# EasyEDA Pro project sleep-monitor.epro

# Schematic sleep_monitor_sch
Assembly Variant: Basic; Board Name: Board1; Create Date: 2026-03-25; Page Name: P1; Project Name: Sleep_Monitor; Schematic Name: Schematic1; Update Date: 2026-03-25; Company: 嘉立创EDA; Page Size: A4; Version: V1.0
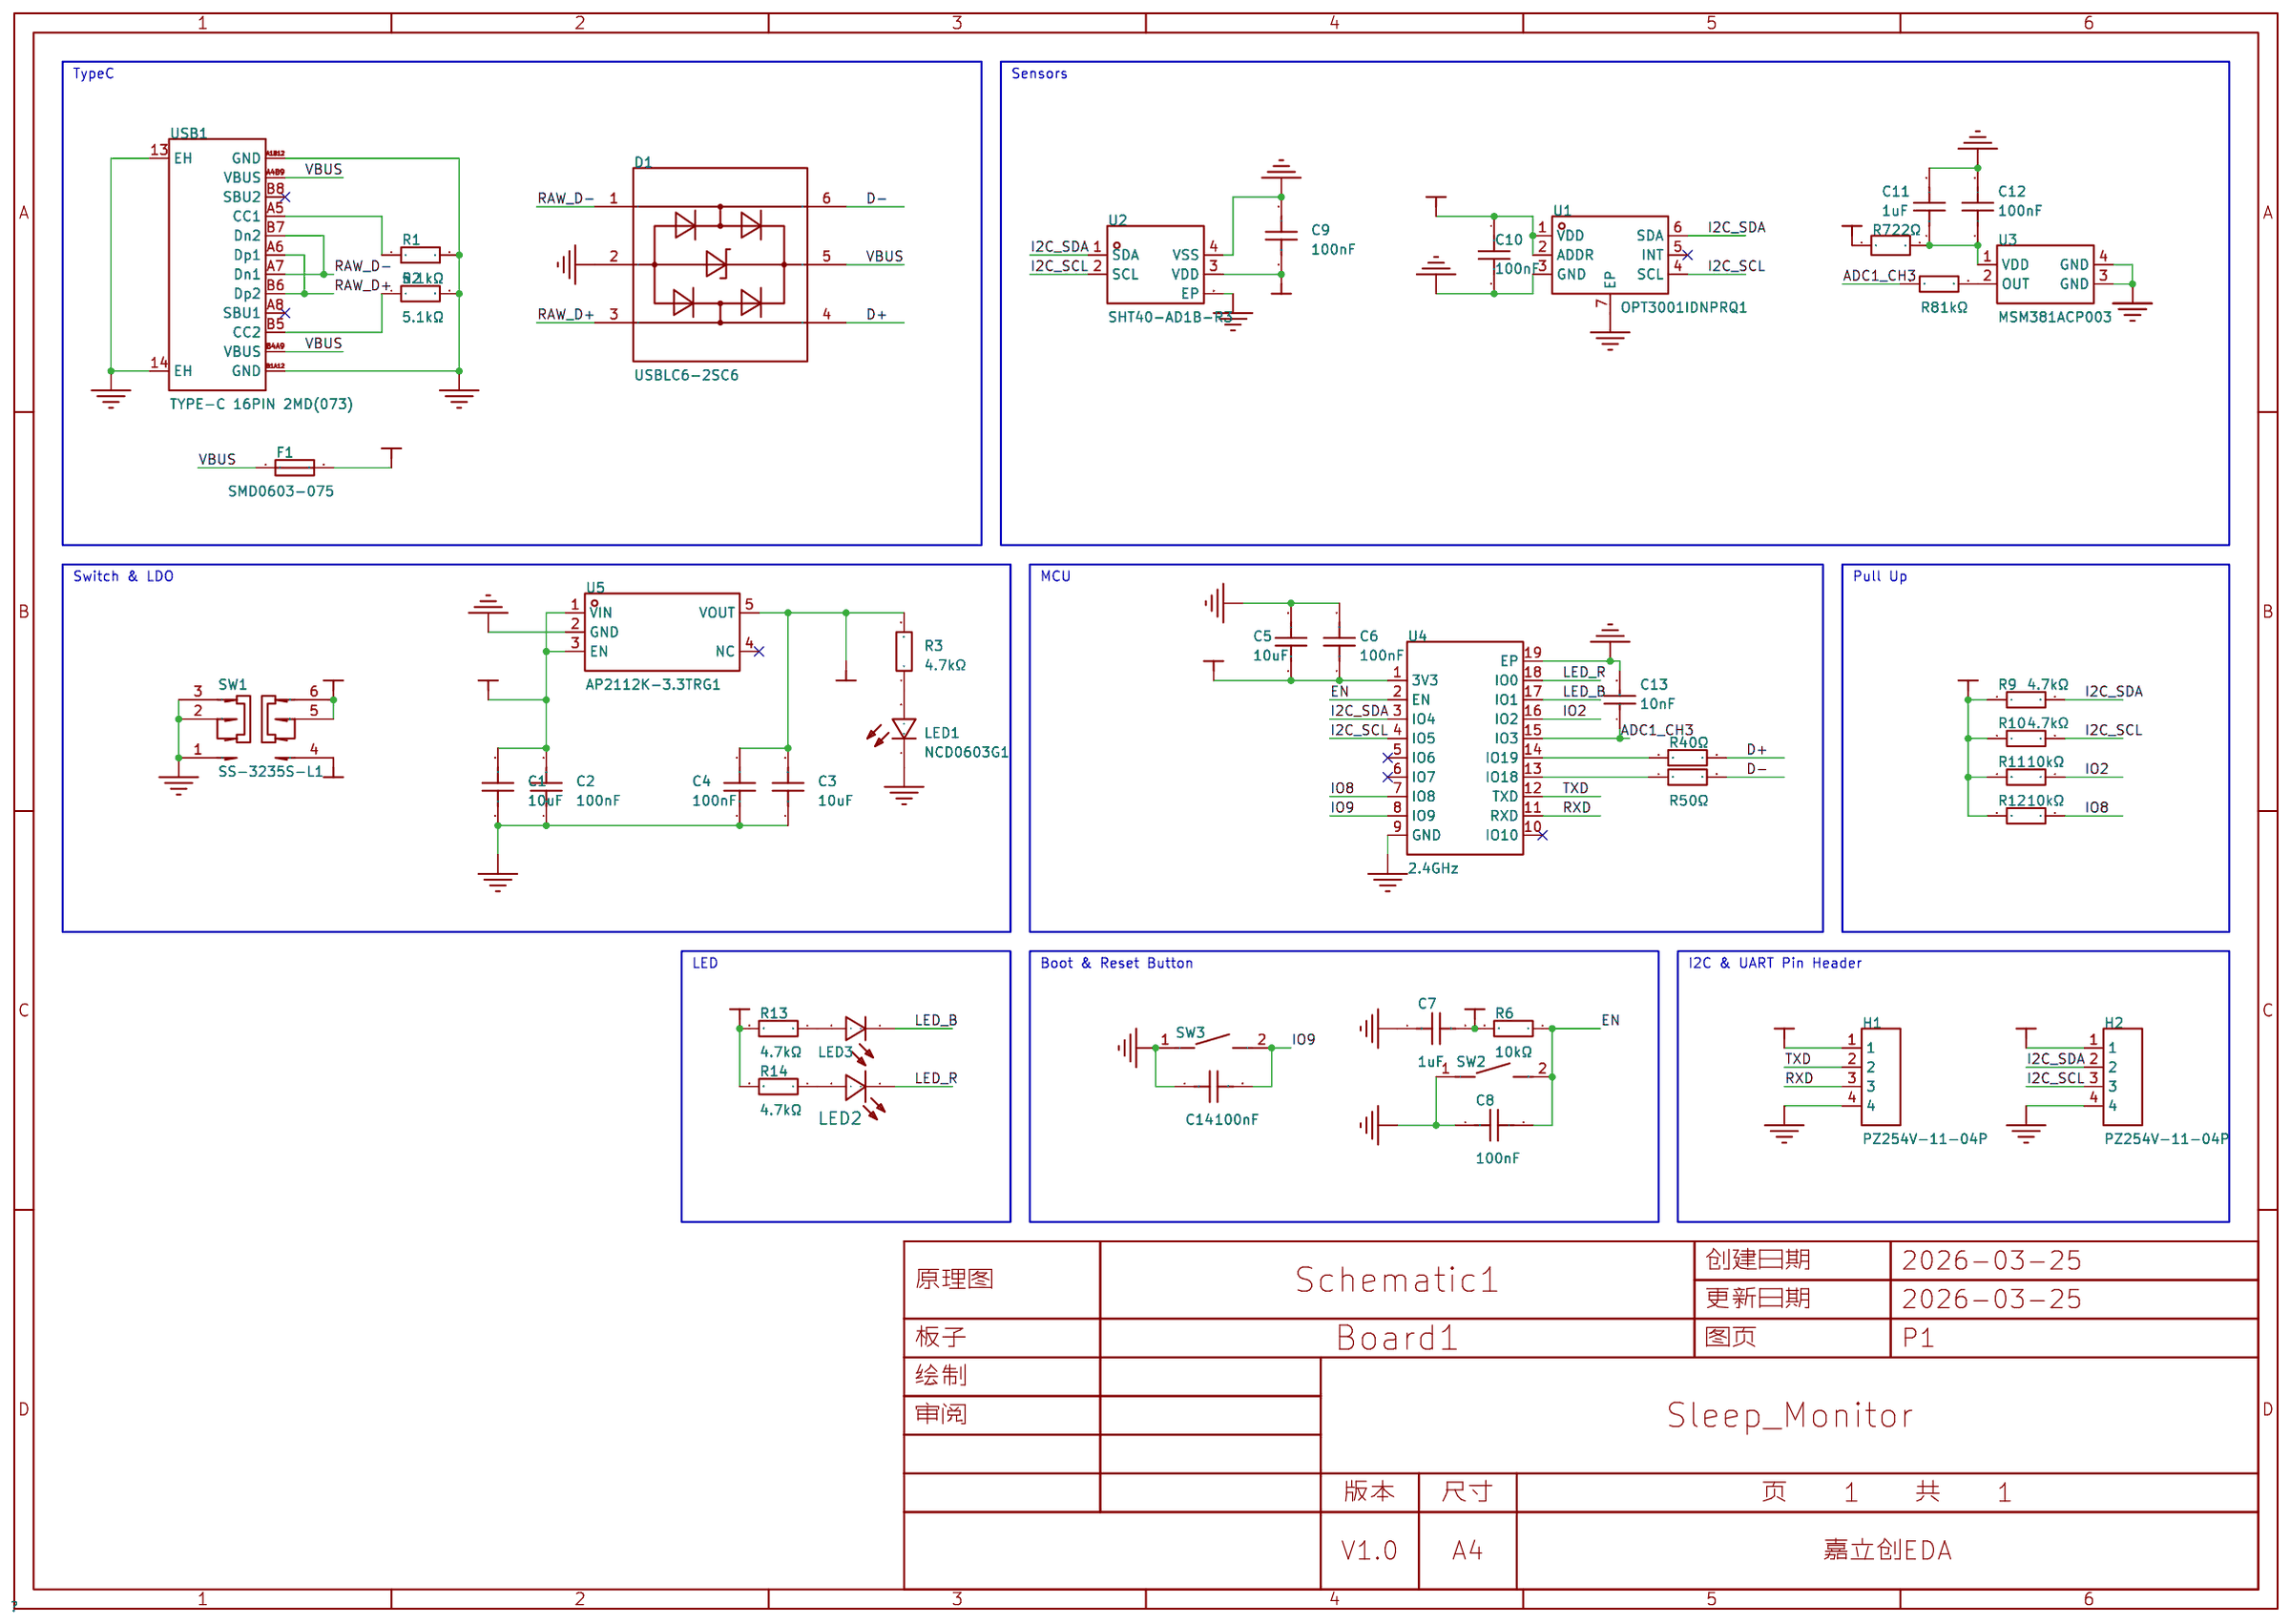
[diagram p0: schematic sheet]

## Parts
C1  10uF  [C0603]
C2  100nF  [C0603]
C3  10uF  [C0603]
C4  100nF  [C0603]
C5  10uF  [C0603]
C6  100nF  [C0603]
C7  1uF  [C0603]
C8  100nF  [C0603]
C9  100nF  [C0603]
C10  100nF  [C0603]
C11  1uF  [C0603]
C12  100nF  [C0603]
C13  10nF  [C0603]
C14  100nF  [C0603]
D1  USBLC6-2SC6  [SOT-23-6_L2.9-W1.6-P0.95-LS2.8-BL]
F1  SMD0603-075  [F0603]
H1  PZ254V-11-04P  [HDR-TH_4P-P2.54-V-M]
H2  PZ254V-11-04P  [HDR-TH_4P-P2.54-V-M]
LED1  NCD0603G1  [LED0603-RD_1]
LED2  NCD0603R5  [LED0603-RD]
LED3  NCD0603B1  [LED0603-RD]
R1  5.1kΩ  [R0603]
R2  5.1kΩ  [R0603]
R3  4.7kΩ  [R0603]
R4  0Ω  [R0603]
R5  0Ω  [R0603]
R6  10kΩ  [R0603]
R7  22Ω  [R0603]
R8  1kΩ  [R0603]
R9  4.7kΩ  [R0603]
R10  4.7kΩ  [R0603]
R11  10kΩ  [R0603]
R12  10kΩ  [R0603]
R13  4.7kΩ  [R0603]
R14  4.7kΩ  [R0603]
SW1  SS-3235S-L1  [SW-SMD_SS-3235S-LX]
SW2  TS-1088-AR02016  [SW-SMD_L3.9-W3.0-P4.45]
SW3  TS-1088-AR02016  [SW-SMD_L3.9-W3.0-P4.45]
U1  OPT3001IDNPRQ1  [WSON-6_L2.0-W2.0-P0.65-BL-EP]
U2  SHT40-AD1B-R3  [DFN-4_L1.5-W1.5-P0.8-TL-EP]
U3  MSM381ACP003  [MIC-SMD_4P-L2.8-W1.9-TR_MSM381ACP003]
U4  2.4GHz  [BULETM-SMD_ESPRESSIF_ESP32-C3-WROOM-02-N4-4MB]
U5  AP2112K-3.3TRG1  [SOT-25-5_L2.9-W1.6-P0.95-LS2.8-BL]
USB1  TYPE-C 16PIN 2MD(073)  [USB-C-SMD_TYPE-C-16PIN-2MD-073]

## Library data of the parts
C1 C3 C5 = CL10A106KP8NNNC: 容值:10uF;精度:±10%;额定电压:10V;温度系数:X5R;; LCSC Part Name: 10uF ±10% 10V; Supplier Part: C19702; Manufacturer: SAMSUNG(三星); Supplier Footprint: 0603; JLCPCB Part Class: Basic Part; Datasheet: https://item.szlcsc.com/datasheet/CL10A106KP8NNNC/20411.html; Supplier: LCSC; Tolerance: ±10%; Voltage Rating: 10V; Temperature Coefficient: X5R
C2 C4 C6 C8-C10 C12 C14 = CL10B104KB8NNNC: 容值:100nF;精度:±10%;额定电压:50V;温度系数:X7R;; LCSC Part Name: 100nF ±10% 50V; Supplier Part: C1591; Manufacturer: SAMSUNG(三星); Supplier Footprint: 0603; JLCPCB Part Class: Extended Part; Datasheet: https://item.szlcsc.com/datasheet/CL10B104KB8NNNC/1943.html; Supplier: LCSC; Tolerance: ±10%; Voltage Rating: 50V; Temperature Coefficient: X7R
C7 C11 = CL10A105KB8NNNC: 容值:1uF;精度:±10%;额定电压:50V;温度系数:X5R;; LCSC Part Name: 1uF ±10% 50V; Supplier Part: C15849; Manufacturer: SAMSUNG(三星); Supplier Footprint: 0603; JLCPCB Part Class: Basic Part; Datasheet: https://item.szlcsc.com/datasheet/CL10A105KB8NNNC/16531.html; Supplier: LCSC; Tolerance: ±10%; Voltage Rating: 50V; Temperature Coefficient: X5R
C13 = 0603B103K500NT: 容值:10nF;精度:±10%;额定电压:50V;温度系数:X7R;; LCSC Part Name: 10nF ±10% 50V; Supplier Part: C57112; Manufacturer: FH(风华); Supplier Footprint: 0603; JLCPCB Part Class: Basic Part; Datasheet: https://item.szlcsc.com/datasheet/0603B103K500NT/58143.html; Supplier: LCSC; Tolerance: ±10%; Voltage Rating: 50V; Temperature Coefficient: X7R
D1 = USBLC6-2SC6_C7519: 极性:单向;反向截止电压(Vrwm):5.25V;钳位电压:17V;峰值脉冲电流(Ipp):5A;击穿电压:6V;; LCSC Part Name: 单向ESD; Supplier Part: C7519; Manufacturer: ST(意法半导体); Supplier Footprint: SOT-23-6L; JLCPCB Part Class: Extended Part; Datasheet: https://item.szlcsc.com/datasheet/USBLC6-2SC6/7996.html; Supplier: LCSC; Polarity: 单向; Reverse Stand-Off Voltage (Vrwm): 5.25V; Clamping Voltage: 17V; Peak Pulse Current (Ipp): 5A; Voltage - Breakdown: 6V; Reverse Leakage Current (Ir): 150nA; Number of Channels: 双路; Operating Temperature: -40℃~+125℃; level of protection: IEC 61000-4-2; Type: ESD; Junction Capacitance: 3.5pF
F1 = SMD0603-075: 耐压:6V;最大电流:40A;保持电流(Ih):750mA;跳闸电流:1.4A;; LCSC Part Name: 6V 750mA 0603自恢复; Supplier Part: C70053; Manufacturer: 台湾陆海; Supplier Footprint: 0603; JLCPCB Part Class: Extended Part; Datasheet: https://atta.szlcsc.com/upload/public/pdf/source/20160331/1459396375678.pdf; Supplier: LCSC; Voltage - Max: 6V; Current - Max: 40A; Hold Current: 750mA; Trip Current: 1.4A
H1 H2 = PZ254V-11-04P_C492403: 插针结构:1x4P;间距:2.54mm;行距:-;圆针/方针:方针;安装方式:直插;排数:单排;总PIN位数:4P;额定电流:3A;额定电压:250V;配合针长度:6mm;塑高:2.5mm;端接针长度:3mm;触头材质:黄铜;触头镀层:-;工作温度:-40℃~+105℃;颜色:黑色;; LCSC Part Name: 1x4P 间距:2.54mm 方针 直插; Supplier Part: C492403; Manufacturer: XFCN(兴飞); Supplier Footprint: 插件,P=2.54mm; JLCPCB Part Class: Extended Part; Datasheet: https://item.szlcsc.com/datasheet/PZ254V-11-04P/502959.html; Supplier: LCSC; Pin Structure: 1x4P; Pitch: 2.54mm; Circluar Pins/Square Pins: 方针; Mounting Type: 直插; Number of Rows: 单排; Number of Pins: 4P; Current Rating: 3A; Voltage Rating (Max): 250V; Length of Mating Pin: 6mm; Insulation Height: 2.5mm; Length of End Connection Pin: 3mm; Contact Material: 黄铜; Operating Temperature: -40℃~+105℃; Color: 黑色
LED1 = NCD0603G1: 灯头类型:-;发光颜色:翠绿色;正向压降(Vf):2.6V~3.6V;功率:72mW;正向电流:20mA;波长:515nm~530nm;二极管配置:独立二极管;透镜颜色:-;色温:-;发光强度:900mcd;发光角度:130°;载带方式:-;工作温度:-30℃~+85℃;; LCSC Part Name: 片式发光二极管; Supplier Part: C84267; Manufacturer: 国星光电; Supplier Footprint: 0603; JLCPCB Part Class: Extended Part; Datasheet: https://item.szlcsc.com/datasheet/NCD0603G1/85436.html; Supplier: LCSC; Illumination Color: 翠绿色; Voltage - Forward(Vf): 2.6V~3.6V; Power(Watts): 72mW; Forward Current: 20mA; Wavelength - Dominant: 515nm~530nm; Peak Wavelength: 520nm; Diode Configuration: 独立二极管; Luminous Intensity: 900mcd; Viewing Angle: 130°; Operating Temperature: -30℃~+85℃
LED2 = NCD0603R5: 灯头类型:-;发光颜色:红色;正向压降(Vf):1.6V~2.6V;功率:65mW;正向电流:25mA;波长:615nm~630nm;二极管配置:独立二极管;透镜颜色:-;色温:-;发光强度:260mcd;发光角度:130°;载带方式:-;工作温度:-30℃~+85℃;; LCSC Part Name: 片式发光二极管; Supplier Part: C193902; Manufacturer: 国星光电; Supplier Footprint: 0603; JLCPCB Part Class: Extended Part; Datasheet: https://item.szlcsc.com/datasheet/NCD0603R5/232976.html; Supplier: LCSC; Illumination Color: 红色; Voltage - Forward(Vf): 1.6V~2.6V; Power(Watts): 65mW; Forward Current: 25mA; Wavelength - Dominant: 615nm~630nm; Peak Wavelength: 630nm; Diode Configuration: 独立二极管; Luminous Intensity: 260mcd; Viewing Angle: 130°; Operating Temperature: -30℃~+85℃
LED3 = NCD0603B1: 灯头类型:-;发光颜色:蓝色;正向压降(Vf):2.6V~3.6V;功率:72mW;正向电流:10mA;波长:463nm~475nm;二极管配置:独立二极管;透镜颜色:-;色温:-;发光强度:220mcd;发光角度:130°;载带方式:-;工作温度:-30℃~+85℃;; LCSC Part Name: 片式发光二极管; Supplier Part: C84266; Manufacturer: 国星光电; Supplier Footprint: 0603; JLCPCB Part Class: Extended Part; Datasheet: https://item.szlcsc.com/datasheet/NCD0603B1/85435.html; Supplier: LCSC; Illumination Color: 蓝色; Voltage - Forward(Vf): 2.6V~3.6V; Power(Watts): 72mW; Forward Current: 10mA; Wavelength - Dominant: 463nm~475nm; Peak Wavelength: 465nm; Diode Configuration: 独立二极管; Luminous Intensity: 220mcd; Viewing Angle: 130°; Operating Temperature: -30℃~+85℃
R1 R2 = 0603WAF5101T5E: 电阻类型:厚膜电阻;阻值:5.1kΩ;精度:±1%;功率:100mW;工作电压:75V;温度系数:±100ppm/℃;; LCSC Part Name: 5.1kΩ ±1% 100mW 厚膜电阻; Supplier Part: C23186; Manufacturer: UNI-ROYAL(厚声); Supplier Footprint: 0603; JLCPCB Part Class: Basic Part; Datasheet: https://item.szlcsc.com/datasheet/0603WAF5101T5E/23913.html; Supplier: LCSC; Type: 厚膜电阻; Tolerance: ±1%; Power(Watts): 100mW; Voltage-Supply(Max): 75V; Temperature Coefficient: ±100ppm/℃; Operating Temperature: -55℃~+155℃
R3 R9 R10 R13 R14 = 0603WAF4701T5E: 电阻类型:厚膜电阻;阻值:4.7kΩ;精度:±1%;功率:100mW;工作电压:75V;温度系数:±100ppm/℃;; LCSC Part Name: 4.7kΩ ±1% 100mW 厚膜电阻; Supplier Part: C23162; Manufacturer: UNI-ROYAL(厚声); Supplier Footprint: 0603; JLCPCB Part Class: Basic Part; Datasheet: https://item.szlcsc.com/datasheet/0603WAF4701T5E/23889.html; Supplier: LCSC; Type: 厚膜电阻; Tolerance: ±1%; Power(Watts): 100mW; Voltage-Supply(Max): 75V; Temperature Coefficient: ±100ppm/℃; Operating Temperature: -55℃~+155℃
R4 R5 = 0603WAF0000T5E: 电阻类型:厚膜电阻;阻值:0Ω;精度:±1%;功率:100mW;工作电压:75V;温度系数:-;; LCSC Part Name: 0Ω ±1% 100mW 厚膜电阻; Supplier Part: C21189; Manufacturer: UNI-ROYAL(厚声); Supplier Footprint: 0603; JLCPCB Part Class: Basic Part; Datasheet: https://item.szlcsc.com/datasheet/0603WAF0000T5E/21903.html; Supplier: LCSC; Type: 厚膜电阻; Tolerance: ±1%; Power(Watts): 100mW; Voltage-Supply(Max): 75V; Operating Temperature: -55℃~+155℃
R6 R11 R12 = 0603WAF1002T5E: 电阻类型:厚膜电阻;阻值:10kΩ;精度:±1%;功率:100mW;工作电压:75V;温度系数:±100ppm/℃;; LCSC Part Name: 厚膜电阻 10kΩ ±1% 100mW; Supplier Part: C25804; Manufacturer: UNI-ROYAL(厚声); Supplier Footprint: 0603; JLCPCB Part Class: Basic Part; Datasheet: https://item.szlcsc.com/datasheet/0603WAF1002T5E/26547.html; Supplier: LCSC; Type: 厚膜电阻; Tolerance: ±1%; Power(Watts): 100mW; Voltage-Supply(Max): 75V; Temperature Coefficient: ±100ppm/℃; Operating Temperature: -55℃~+155℃
R7 = FRC0603F22R0TS: 电阻类型:厚膜电阻;阻值:22Ω;精度:±1%;功率:100mW;工作电压:75V;温度系数:±100ppm/℃;; LCSC Part Name: 22Ω ±1% 100mW 厚膜电阻; Supplier Part: C2930077; Manufacturer: FOJAN(富捷); Supplier Footprint: 0603; JLCPCB Part Class: Extended Part; Supplier: LCSC; Type: 厚膜电阻; Tolerance: ±1%; Power(Watts): 100mW; Voltage-Supply(Max): 75V; Temperature Coefficient: ±100ppm/℃; Operating Temperature: -55℃~+155℃
R8 = 0603WAF1001T5E: 电阻类型:厚膜电阻;阻值:1kΩ;精度:±1%;功率:100mW;工作电压:75V;温度系数:±100ppm/℃;; LCSC Part Name: 1kΩ ±1% 100mW 厚膜电阻; Supplier Part: C21190; Manufacturer: UNI-ROYAL(厚声); Supplier Footprint: 0603; JLCPCB Part Class: Basic Part; Datasheet: https://item.szlcsc.com/datasheet/0603WAF1001T5E/21904.html; Supplier: LCSC; Type: 厚膜电阻; Tolerance: ±1%; Power(Watts): 100mW; Voltage-Supply(Max): 75V; Temperature Coefficient: ±100ppm/℃; Operating Temperature: -55℃~+155℃
SW1 = SS-3235S-L1: 电路结构:双刀双掷;安装方式:卧贴;开关颜色:黑色;额定电流:50mA;额定电压:12V;工作寿命:1万次;; LCSC Part Name: 柄长2mm 卧贴双档 滑动开关; Supplier Part: C500055; Manufacturer: XKB Connection(中国星坤); Supplier Footprint: SMD,9.1x3.6mm; JLCPCB Part Class: Extended Part; Datasheet: https://item.szlcsc.com/datasheet/SS-3235S-L1/512181.html; Supplier: LCSC; Circuit: 双刀双掷; Actuator Style: 矩形柱状; Termination Style: 鸥翼型; Length: 9.1mm; Width: 3.55mm; Switch Height: 3.2mm; Mounting Type: 卧贴; Actuator Color: 黑色; Current Rating: 50mA; Voltage Rating: 12V; Life: 1万次; Operating Temperature: -40℃~+85℃
SW2 SW3 = TS-1088-AR02016: 电路结构:单刀单掷;按钮形状:圆形按钮;作用力:1.6N;安装方式:立贴;开关长度:4mm;开关宽度:3mm;开关高度:2mm;带支架:不带支架;触点电流:50mA;额定电压:12V;工作寿命:10万次;; LCSC Part Name: 4*3*2mm 立贴 轻触开关; Supplier Part: C720477; Manufacturer: XUNPU(讯普); Supplier Footprint: SMD,4x3mm; JLCPCB Part Class: Basic Part; Datasheet: https://item.szlcsc.com/datasheet/TS-1088-AR02016/763484.html; Supplier: LCSC; Circuit: 单刀单掷; Actuator Style: 圆形按钮; Operating Force: 1.6N; Mounting Type: 立贴; Length: 4mm; Width: 3mm; Switch Height: 2mm; with Bracket: 不带支架; Contact Current: 50mA; Voltage Rating: 12V; Actuator/Cap Color: 黑色; Termination Style: SMD接片; Life: 10万次; Operating Temperature: -30℃~+80℃
U1 = OPT3001IDNPRQ1: OPT3001-Q1 具有高精度人眼响应功能的汽车数字环境光传感器 (ALS); Supplier Part: C2861428; Manufacturer: TI(德州仪器); Supplier Footprint: WSON-6-EP(2x2); JLCPCB Part Class: Extended Part; Datasheet: https://www.ti.com/cn/lit/gpn/opt3001-q1; Supplier: LCSC
U2 = SHT40-AD1B-R3: 温度范围:-40℃~+125℃;湿度范围:0%RH~100%RH;接口类型:I2C;湿度精度:±1.8%RH;; LCSC Part Name: 3.000.353 3.000.353 ±1.8%（典型）/ 最大 ±3.5% RH 的数字式温湿度传感器（地址 0x44）; Supplier Part: C2848306; Manufacturer: Sensirion(瑞士盛思锐); Supplier Footprint: DFN-4-EP(1.5x1.5); JLCPCB Part Class: Extended Part; Datasheet: https://item.szlcsc.com/datasheet/SHT40-AD1B-R3/3046541.html; Supplier: LCSC; Temperature Range: -40℃~+125℃; Humidity: 0%RH~100%RH; Interface: I2C; Voltage - Supply: 1.08V~3.6V; Current - Supply: 400nA; Humidity Tolerance: ±1.8%RH; Temperature Tolerance: ±0.2℃; Resolution: 16bit; Features: 内置加热器
U3 = MSM381ACP003_C51928212: 指向性:全指向型;信噪比:64dB;灵敏度:-38dB;阻抗:170Ω;; Supplier Part: C51928212; Manufacturer: MEMS(敏芯微); Supplier Footprint: LGA-4(1.9x2.8); JLCPCB Part Class: Extended Part; Datasheet: https://item.szlcsc.com/datasheet/MSM381ACP003/54640767.html; Supplier: LCSC; Direction: 全指向型; Voltage - Supply: 1.8V; Current Consumption: 175uA; S/N Ratio: 64dB; Sensitivity: -38dB; Impedance: 170Ω; Output Type: 模拟输出; Length: 2.75mm; Width: 1.85mm; Height: 1mm
U4 = ESP32-C3-WROOM-02-N4: 核心芯片:ESP32-C3芯片;频率:2.4GHz;天线形式:板载PCB天线;发射功率:20.5dBm;接收灵敏度:-105dBm;; LCSC Part Name: 不带固件 2.4GHz Wi-Fi（802.11b/g/n）+ 蓝牙5模组; Supplier Part: C2934560; Manufacturer: ESPRESSIF(乐鑫); Supplier Footprint: VFQFN-32-EP; JLCPCB Part Class: Extended Part; Datasheet: https://item.szlcsc.com/datasheet/ESP32-C3-WROOM-02-N4/3281215.html; Supplier: LCSC; Utilized IC / Part: ESP32-C3芯片; Wireless Standard: Bluetooth5.0; Interface Type: I2S；I2C；JTAG；UART；USB；SPI; Antenna Type: 板载PCB天线; Output Power: 20.5dBm; Voltage - Supply: 3V~3.6V; Receive  Current: 82mA; Send  Current: 345mA; Sensitivity: -105dBm; Operating Temperature: -40℃~+85℃
U5 = AP2112K-3.3TRG1: 输出类型:固定;工作电压:6V;输出电压:3.3V;输出电流:600mA;电源纹波抑制比(PSRR):65dB@(1kHz);输出极性:正极;; LCSC Part Name: 输入6V 输出3.3V 600mA; Supplier Part: C51118; Manufacturer: DIODES(美台); Supplier Footprint: SOT-25-5; JLCPCB Part Class: Extended Part; Datasheet: https://item.szlcsc.com/datasheet/AP2112K-3.3TRG1/52131.html; Supplier: LCSC; Output Type: 固定; Voltage - Supply: 6V; Output Voltage: 3.3V; Output Current: 600mA; Power Supply Rejection Ratio (PSRR): 65dB@(1kHz); Voltage Dropout: 250mV@(600mA); standby current: 55uA; Noise: 50uVrms; Features: 带使能；过热保护；过流保护; Operating Temperature: -40℃~+85℃@(Ta); Output Configuration: 正极; Number of Outputs: 1
USB1 = TYPE-C 16PIN 2MD(073): 连接器类型:Type-C;协议标准:-;公母:母;安装方式:卧贴;触点数量:16P;端口数量:1;额定电流 - 电源:3A;工作温度:-25℃~+85℃;; LCSC Part Name: Type-C 母 卧贴; Supplier Part: C2765186; Manufacturer: SHOU HAN(首韩); Supplier Footprint: SMD; JLCPCB Part Class: Extended Part; Datasheet: https://item.szlcsc.com/datasheet/TYPE-C%252016PIN%25202MD(073)/2901843.html; Supplier: LCSC; Connector Type: Type-C; Gender: 母; Mounting Type: 卧贴; Number of Contacts: 16P; Number of Ports: 1; Current Rating-Power: 3A; Voltage Rating: 5V; Connect-Disconnect Life: 1万次; Detection color: 黑色; Operating Temperature: -25℃~+85℃

## Nets
+3.3V: C3.2 C4.2 C5.1 C6.1 C7.2 C9.2 C10.1 H1.1 H2.1 R3.2 R6.2 R7.1 R9.1 R10.1 R11.2 R12.2 R13.2 R14.2 U1.1(VDD) U1.2(ADDR) U2.3(VDD) U4.1(3V3) U5.5(VOUT)
+5V: C1.2 C2.2 SW1.5 SW1.6 U5.1(VIN) U5.3(EN)
GND: C1.1 C2.1 C3.1 C4.1 C5.2 C6.2 C7.1 C8.1 C9.1 C10.2 C11.2 C12.2 C13.2 C14.1 D1.2 H1.4 H2.4 LED1.1(K) R1.2 R2.2 SW1.1 SW1.2 SW1.3 SW2.1 SW3.1 U1.3(GND) U1.7(EP) U2.4(VSS) U2.5(EP) U3.3(GND) U3.4(GND) U4.9(GND) U4.19(EP) U5.2(GND) USB1.13(EH) USB1.14(EH) USB1.A1B12(GND) USB1.B1A12(GND)
VBUS: D1.5 F1.1 USB1.A4B9(VBUS) USB1.B4A9(VBUS)
VCC+5V: F1.2 SW1.4
ADC1_CH3: C13.1 R8.1 U4.15(IO3)
D+: D1.4 R4.2
D-: D1.6 R5.2
EN: C8.2 R6.1 SW2.2 U4.2(EN)
I2C_SCL: H2.3 R10.2 U1.4(SCL) U2.2(SCL) U4.4(IO5)
I2C_SDA: H2.2 R9.2 U1.6(SDA) U2.1(SDA) U4.3(IO4)
IO2: R11.1 U4.16(IO2)
IO8: R12.1 U4.7(IO8)
IO9: C14.2 SW3.2 U4.8(IO9)
LED_B: LED3.1(-) U4.17(IO1)
LED_R: LED2.1(-) U4.18(IO0)
RAW_D+: D1.3 USB1.A6(Dp1) USB1.B6(Dp2)
RAW_D-: D1.1 USB1.A7(Dn1) USB1.B7(Dn2)
RXD: H1.3 U4.11(RXD)
TXD: H1.2 U4.12(TXD)
$1N25: R1.1 USB1.A5(CC1)
$1N26: R2.1 USB1.B5(CC2)
$1N67: R4.1 U4.14(IO19)
$1N125: R8.2 U3.2(OUT)
$1N130: C11.1 C12.1 R7.2 U3.1(VDD)
$1N133: R5.1 U4.13(IO18)
$1N168: LED1.2(A) R3.1
$1N183: LED3.2(+) R13.1
$1N184: LED2.2(+) R14.1

Not connected (* = marked no-connect by the designer): U1 5(INT)*; U4 5(IO6)* 6(IO7)* 10(IO10)*; U5 4(NC)*; USB1 A8(SBU1)* B8(SBU2)*

## Notes on the sheet
- TypeC
- Sensors
- Switch & LDO
- MCU
- Pull Up
- LED
- Boot & Reset Button
- I2C & UART Pin Header

# Board sleep_monitor_pcb
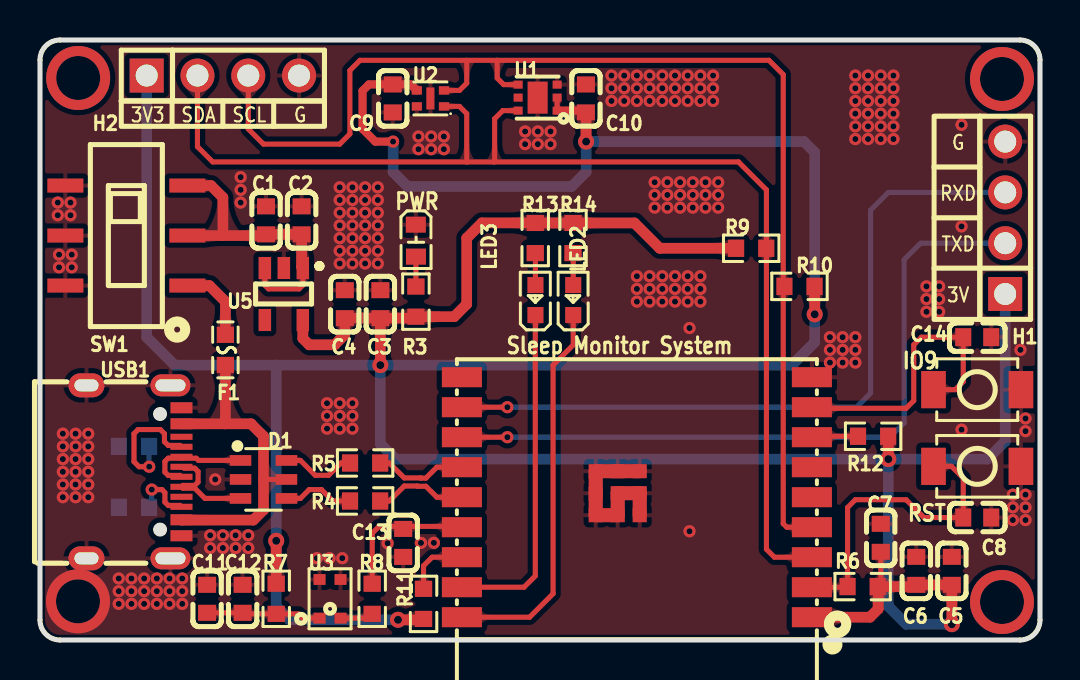
[diagram p1: board, top side]
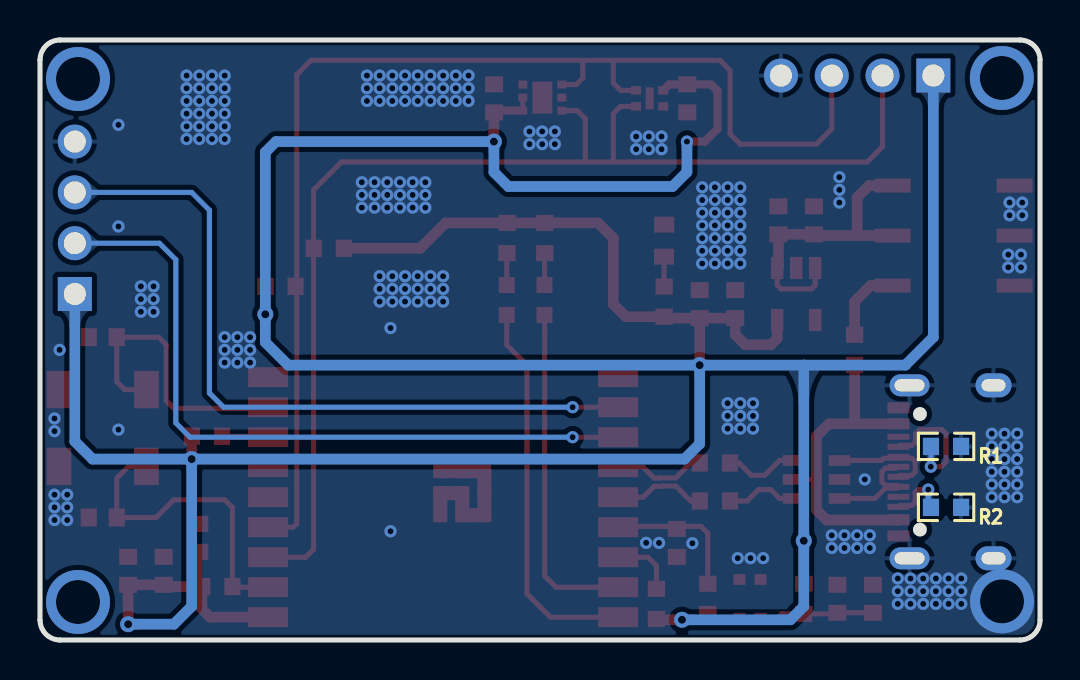
[diagram p2: board, bottom side, seen from below]

Outline 50 x 30 mm; copper layers: Top Layer, Bottom Layer. Coordinates in mm from the lower left corner of the outline.
Outline path: 0,29 0,1 arc(0.29,0.29) 1,0 49,0 arc(49.71,0.29) 50,1 50,29 arc(49.71,29.71) 49,30 1,30 arc(0.29,29.71) 0,29
Stack: Top Layer 0.035mm / Dielectric1 1.51mm FR4 er 4.5 / Bottom Layer 0.035mm

## Design rules (mm)
net RAW_D-: DP1
net RAW_D+: DP1
net D+: DP2
net D-: DP2
net $1N67: DP3
net $1N133: DP3
spacing copperThickness1oz (default): track to track 0.102, other pairs 0.152 to 0.3
spacing copperThickness2oz: track to track 0.203, other pairs 0.152 to 0.3
track width copperThickness1oz (default): min 0.127, default 0.254, max 2.54
track width copperThickness2oz: min 0.203, default 0.254, max 2.54
differential pair differentialPair (default): width min 0.127, default 0.254, max 2.54; gap min 0.152, default 0.152
net GND uses copperRegion

## Placement (name value [footprint] x y rotation side)
C1  10uF  [C0603]  11.3 20.98 270 top
C2  100nF  [C0603]  13.08 20.98 270 top
C3  10uF  [C0603]  17.02 16.79 270 top
C4  100nF  [C0603]  15.24 16.79 270 top
C5  10uF  [C0603]  45.59 3.46 90 top
C6  100nF  [C0603]  43.81 3.46 90 top
C7  1uF  [C0603]  42.04 5.11 270 top
C8  100nF  [C0603]  46.86 6.12 180 top
C9  100nF  [C0603]  17.64 27.08 90 top
C10  100nF  [C0603]  27.3 27.08 90 top
C11  1uF  [C0603]  8.36 2.06 90 top
C12  100nF  [C0603]  10.13 2.06 90 top
C13  10nF  [C0603]  18.16 4.85 270 top
C14  100nF  [C0603]  46.86 15.14 180 top
D1  USBLC6-2SC6  [SOT-23-6_L2.9-W1.6-P0.95-LS2.8-BL]  11.18 8.03 270 top
F1  SMD0603-075  [F0603]  9.27 14.51 90 top
H1  PZ254V-11-04P  [HDR-TH_4P-P2.54-V-M]  48.26 21.11 90 top
H2  PZ254V-11-04P  [HDR-TH_4P-P2.54-V-M]  9.14 28.22 0 top
LED1  NCD0603G1  [LED0603-RD_1]  18.8 19.97 270 top
LED2  NCD0603R5  [LED0603-RD]  26.66 17 90 top
LED3  NCD0603B1  [LED0603-RD]  24.77 17 90 top
R1  5.1kΩ  [R0603]  4.7 9.68 180 bottom
R2  5.1kΩ  [R0603]  4.7 6.63 180 bottom
R3  4.7kΩ  [R0603]  18.8 16.92 270 top
R4  0Ω  [R0603]  16.26 6.95 180 top
R5  0Ω  [R0603]  16.26 8.85 180 top
R6  10kΩ  [R0603]  41.13 2.67 0 top
R7  22Ω  [R0603]  11.81 2.06 270 top
R8  1kΩ  [R0603]  16.61 2.06 270 top
R9  4.7kΩ  [R0603]  35.56 19.59 0 top
R10  4.7kΩ  [R0603]  37.97 17.68 180 top
R11  10kΩ  [R0603]  19.18 1.81 270 top
R12  10kΩ  [R0603]  41.66 10.19 0 top
R13  4.7kΩ  [R0603]  24.76 20.1 90 top
R14  4.7kΩ  [R0603]  26.65 20.1 90 top
SW1  SS-3235S-L1  [SW-SMD_SS-3235S-LX]  4.32 20.22 90 top
SW2  TS-1088-AR02016  [SW-SMD_L3.9-W3.0-P4.45]  46.86 8.68 180 top
SW3  TS-1088-AR02016  [SW-SMD_L3.9-W3.0-P4.45]  46.86 12.52 180 top
U1  OPT3001IDNPRQ1  [WSON-6_L2.0-W2.0-P0.65-BL-EP]  24.88 27.12 90 top
U2  SHT40-AD1B-R3  [DFN-4_L1.5-W1.5-P0.8-TL-EP]  19.52 27.08 180 top
U3  MSM381ACP003  [MIC-SMD_4P-L2.8-W1.9-TR_MSM381ACP003]  14.5 2.06 180 top
U4  2.4GHz  [BULETM-SMD_ESPRESSIF_ESP32-C3-WROOM-02-N4-4MB]  29.84 7.14 180 top
U5  AP2112K-3.3TRG1  [SOT-25-5_L2.9-W1.6-P0.95-LS2.8-BL]  12.19 17.3 180 top
USB1  TYPE-C 16PIN 2MD(073)  [USB-C-SMD_TYPE-C-16PIN-2MD-073]  4.7 8.41 270 top

## Footprints (pads in the part's own frame, mm; a bottom-side part is the same pattern mirrored in y, then rotated)
BULETM-SMD_ESPRESSIF_ESP32-C3-WROOM-02-N4-4MB
  rect 2x1 smd: 1(-8.75,6) 2(-8.75,4.5) 3(-8.75,3) 4(-8.75,1.5) 5(-8.75,0) 6(-8.75,-1.5) 7(-8.75,-3) 8(-8.75,-4.5) 9(-8.75,-6) 10(8.75,-6) 11(8.75,-4.5) 12(8.75,-3) 13(8.75,-1.5) 14(8.75,0) 15(8.75,1.5) 16(8.75,3) 17(8.75,4.5) 18(8.75,6)
  rect 0.7x0.7 smd: 19(-0.14,0.9) 19(-0.14,-0.2) 19(-0.14,-1.3) 19(0.96,0.9) 19(0.96,-0.2) 19(0.96,-1.3) 19(2.06,0.9) 19(2.06,-0.2) 19(2.06,-1.3)
C0603
  rect 0.8x0.9 smd: 1(-0.7,0) 2(0.7,0)
DFN-4_L1.5-W1.5-P0.8-TL-EP
  rect 0.505x0.42 smd: 1(-0.677,0.4) 2(-0.677,-0.4) 3(0.677,-0.4) 4(0.677,0.4)
  rect 0.4x1.1 smd: 5(0,0)
F0603
  rect 0.806x0.864 smd: 1(-0.753,0) 2(0.753,0)
HDR-TH_4P-P2.54-V-M
  rect 1.7x1.7 hole 1.1: 1(-3.81,0)
  round 1.7 hole 1.1: 2(-1.27,0) 3(1.27,0) 4(3.81,0)
LED0603-RD
  rect 0.8x0.8 smd: 1(-0.749,0) 2(0.749,0)
LED0603-RD_1
  rect 0.8x1 smd: 1(-0.799,-0.004) 2(0.799,0.004)
MIC-SMD_4P-L2.8-W1.9-TR_MSM381ACP003
  rect 0.6x0.54 smd: 1(0.525,0.965) 2(-0.525,0.965) 3(-0.525,-0.965) 4(0.525,-0.965)
R0603
  rect 0.806x0.864 smd: 1(-0.753,0) 2(0.753,0)
SOT-23-6_L2.9-W1.6-P0.95-LS2.8-BL
  rect 0.532x1.072 smd: 1(-0.95,-1.149) 2(0,-1.149) 3(0.95,-1.149) 4(0.95,1.149) 5(0,1.149) 6(-0.95,1.149)
SOT-25-5_L2.9-W1.6-P0.95-LS2.8-BL
  rect 0.623x1.105 smd: 1(-0.95,-1.3) 2(-0.001,-1.3) 3(0.95,-1.3) 4(0.95,1.3) 5(-0.95,1.3)
SW-SMD_L3.9-W3.0-P4.45
  rect 1.23x1.86 smd: 1(-2.185,0) 2(2.185,0)
SW-SMD_SS-3235S-LX
  rect 0.7x1.8 smd: 1(-2.5,3.05) 2(0,3.05) 3(2.5,3.05) 4(-2.5,-3.05) 5(0,-3.05) 6(2.5,-3.05)
USB-C-SMD_TYPE-C-16PIN-2MD-073
  oval 1.1x2 hole 0.6x1.5: 13(-4.325,1.825) 14(4.325,1.825)
  oval 1.2x1.8 hole 0.6x1.2: 13(-4.325,-2.375) 14(4.325,-2.375)
  rect 0.55x1.1 smd: A1B12(-3.2,2.375) A4B9(-2.4,2.375) B1A12(3.2,2.375) B4A9(2.4,2.375)
  rect 0.3x1.1 smd: A5(-1.25,2.375) A6(-0.25,2.375) A7(0.25,2.375) A8(1.25,2.375) B5(1.75,2.375) B6(0.75,2.375) B7(-0.75,2.375) B8(-1.75,2.375)
WSON-6_L2.0-W2.0-P0.65-BL-EP
  rect 0.4x0.45 smd: 1(-0.65,-0.975) 2(0,-0.975) 3(0.65,-0.975) 4(0.65,0.975) 5(0,0.975) 6(-0.65,0.975)
  rect 1.6x1 smd: 7(0,0)

## Nets
As in the schematic.

Pads without a net: U1 5; U4 5 6 10; U5 4; USB1 A8 B8

## Via types
v1: diameter 3.2, hole 2.2, Top Layer to Bottom Layer, 4 vias
v2: diameter 0.61, hole 0.305, Top Layer to Bottom Layer, 232 vias
v3: diameter 0.8, hole 0.4, Top Layer to Bottom Layer, 7 vias

## Routing (per net, layer and track width the routed paths; a pad name or vN(x,y) marks a point on that pad's centre or on a via; arc(x,y) is an arc through that point)
+3.3V: length 213.4
  Top Layer w0.254: C7.2 42.04,2.82 41.89,2.67 ; U1.1 U1.2
  Top Layer w0.406: U1.1 27.21,26.47 C10.1 ; v2(17.65,24.92) 16.76,24.92 16.13,25.56 16.13,27.46 16.45,27.78 C9.2 18.54,27.78 U2.3
  Top Layer w0.533: v3(42.42,9.05) 42.42,10.18 R12.2 ; v3(27.31,24.92) 27.31,26.37 C10.1 ; 43.98,2.76 C5.1 v3(45.59,0.79) ; R11.2 19.14,1.01 v3(17.9,1.01) ; C3.2 18.72,16.09 R3.2 20.71,16.17 21.34,16.79 21.34,20.09 22.1,20.86 24.76,20.86 R13.2 R14.2 29.72,20.85 30.99,19.59 R9.1 ; C3.2 v3(17.02,13.74) ; C3.2 C4.2 15.24,15.27 14.73,14.76 13.46,14.76 13.14,15.08 13.14,16 ; R10.1 38.73,17.67 v3(38.73,16.28) ; 43.98,2.67 41.89,2.67 41.91,2.65 41.91,1.55 41.5,1.14 38.6,1.14 ; v3(11.81,4.96) R7.1
  Bottom Layer w0.533: 11.8,13.74 6.73,13.74 5.33,15.14 H2.1 ; 11.8,13.74 11.81,13.73 v3(11.81,4.96) 11.81,1.68 12.48,1.01 v3(17.9,1.01) ; 11.8,13.74 v3(17.02,13.74) ; v3(42.42,9.05) 47.37,9.05 48.26,9.93 H1.1 ; v3(42.42,9.05) 42.42,1.68 43.31,0.79 v3(45.59,0.79) ; v3(42.42,9.05) 17.78,9.05 17.02,9.81 v3(17.02,13.74) ; v2(17.65,24.92) 17.65,23.4 18.37,22.67 26.58,22.67 27.31,23.4 v3(27.31,24.92) 38.2,24.92 38.73,24.39 v3(38.73,16.28) 38.73,14.89 37.59,13.74 v3(17.02,13.74)
+5V: length 15.2
  Top Layer w0.254: 13.14,18.6 13.14,17.74 12.95,17.55 11.43,17.55 11.24,17.74 U5.3
  Top Layer w0.533: SW1.5 9.13,20.22 ; 9.13,20.22 11.24,20.22 C1.2 C2.2 13.08,18.66 13.14,18.6 ; 9.13,20.22 9.14,20.24 9.14,22.13 8.55,22.72 SW1.6
GND: length 8.8
  Top Layer w0.701: U4.19 U4.19 U4.19 U4.19 U4.19 U4.19 U4.19 U4.19 U4.19
  vias: v1(1.9,1.93) v2(0.89,21.87) v2(0.89,21.24) v2(0.95,19.27) v2(0.95,18.63) v2(1.14,10.31) v2(1.14,9.68) v2(1.14,9.05) v2(1.14,8.41) v2(1.14,7.78) v2(1.14,7.14) v2(1.52,21.87) v2(1.52,21.24) v2(1.59,19.27) v2(1.59,18.63) v2(1.78,10.31) v2(1.78,9.68) v2(1.78,9.05) v2(1.78,8.41) v2(1.78,7.78) v2(1.78,7.14) v2(2.41,10.31) v2(2.41,9.68) v2(2.41,9.05) v2(2.41,8.41) v2(2.41,7.78) v2(2.41,7.14) v2(3.94,3.08) v2(3.94,2.44) v2(3.94,1.81) v2(4.57,3.08) v2(4.57,2.44) v2(4.57,1.81) v2(5.21,3.08) v2(5.21,2.44) v2(5.21,1.81) v2(5.84,3.08) v2(5.84,2.44) v2(5.84,1.81) v2(6.48,3.08) v2(6.48,2.44) v2(6.48,1.81) v2(7.11,3.08) v2(7.11,2.44) v2(7.11,1.81) v2(8.51,5.23) v2(8.51,4.6) v2(8.76,8.03) v2(9.14,5.23) v2(9.14,4.6) v2(9.78,5.23) v2(9.78,4.6) v2(10.03,23.14) v2(10.03,22.51) v2(10.03,21.87) v2(10.41,5.23) v2(10.41,4.6) v2(13.84,4.09) v2(14.35,11.84) v2(14.35,11.2) v2(14.35,10.57) v2(14.48,4.09) v2(14.99,22.63) v2(14.99,22) v2(14.99,21.36) v2(14.99,20.73) v2(14.99,20.09) v2(14.99,19.46) v2(14.99,18.82) v2(14.99,11.84) v2(14.99,11.2) v2(14.99,10.57) v2(15.11,4.09) v2(15.62,22.63) v2(15.62,22) v2(15.62,21.36) v2(15.62,20.73) v2(15.62,20.09) v2(15.62,19.46) v2(15.62,18.82) v2(15.62,11.84) v2(15.62,11.2) v2(15.62,10.57) v2(16.26,22.63) v2(16.26,22) v2(16.26,21.36) v2(16.26,20.73) v2(16.26,20.09) v2(16.26,19.46) v2(16.26,18.82) v2(16.89,22.63) v2(16.89,22) v2(16.89,21.36) v2(16.89,20.73) v2(16.89,20.09) v2(16.89,19.46) v2(16.89,18.82) v2(17.38,4.84) v2(18.92,25.17) v2(18.92,24.54) v2(19.05,4.85) v2(19.56,25.17) v2(19.56,24.54) v2(19.69,4.86) v2(20.19,25.17) v2(20.19,24.54) v2(24.26,25.43) v2(24.26,24.79) v2(24.89,25.43) v2(24.89,24.79) v2(25.53,25.43) v2(25.53,24.79) v2(28.57,28.22) v2(28.57,27.59) v2(28.57,26.95) v2(29.21,28.22) v2(29.21,27.59) v2(29.21,26.95) v2(29.84,28.22) v2(29.84,27.59) v2(29.84,26.95) v2(29.84,18.19) v2(29.84,17.55) v2(29.84,16.92) v2(30.48,28.22) v2(30.48,27.59) v2(30.48,26.95) v2(30.48,18.19) v2(30.48,17.55) v2(30.48,16.92) v2(30.73,22.89) v2(30.73,22.25) v2(30.73,21.62) v2(31.12,28.22) v2(31.12,27.59) v2(31.12,26.95) v2(31.12,18.19) v2(31.12,17.55) v2(31.12,16.92) v2(31.37,22.89) v2(31.37,22.25) v2(31.37,21.62) v2(31.75,28.22) v2(31.75,27.59) v2(31.75,26.95) v2(31.75,18.19) v2(31.75,17.55) v2(31.75,16.92) v2(32,22.89) v2(32,22.25) v2(32,21.62) v2(32.38,28.22) v2(32.38,27.59) v2(32.38,26.95) v2(32.38,18.19) v2(32.38,17.55) v2(32.38,16.92) v2(32.48,15.6) v2(32.48,5.44) v2(32.64,22.89) v2(32.64,22.25) v2(32.64,21.62) v2(33.02,28.22) v2(33.02,27.59) v2(33.02,26.95) v2(33.02,18.19) v2(33.02,17.55) v2(33.02,16.92) v2(33.27,22.89) v2(33.27,22.25) v2(33.27,21.62) v2(33.66,28.22) v2(33.66,27.59) v2(33.66,26.95) v2(33.91,22.89) v2(33.91,22.25) v2(33.91,21.62) v2(39.5,15.14) v2(39.5,14.51) v2(39.5,13.87) v2(40.13,15.14) v2(40.13,14.51) v2(40.13,13.87) v2(40.77,28.22) v2(40.77,27.59) v2(40.77,26.95) v2(40.77,26.32) v2(40.77,25.68) v2(40.77,25.05) v2(40.77,15.14) v2(40.77,14.51) v2(40.77,13.87) v2(41.4,28.22) v2(41.4,27.59) v2(41.4,26.95) v2(41.4,26.32) v2(41.4,25.68) v2(41.4,25.05) v2(42.04,28.22) v2(42.04,27.59) v2(42.04,26.95) v2(42.04,26.32) v2(42.04,25.68) v2(42.04,25.05) v2(42.67,28.22) v2(42.67,27.59) v2(42.67,26.95) v2(42.67,26.32) v2(42.67,25.68) v2(42.67,25.05) v2(44.32,17.68) v2(44.32,17.05) v2(44.32,16.41) v2(44.96,17.68) v2(44.96,17.05) v2(44.96,16.41) v2(46.08,25.76) v2(46.08,20.68) v2(46.08,10.52) v2(48.64,7.27) v2(48.64,6.63) v2(48.64,6) v2(49.02,14.51) v2(49.28,11.08) v2(49.28,10.44) v2(49.28,7.27) v2(49.28,6.63) v2(49.28,6)
VBUS: length 16.5
  Top Layer w0.254: D1.5 11.18,8.03 11.18,8.02
  Top Layer w0.533: 9.24,10.81 9.27,10.84 F1.1 ; 9.24,10.81 USB1.A4B9 ; 9.24,10.81 10.55,10.81 11.18,10.19 11.18,6.5 10.67,6 7.09,6 USB1.B4A9
VCC+5V: length 3.9
  Top Layer w0.533: F1.2 9.27,16.92 8.47,17.72 SW1.4
(no net):
  vias: v1(1.91,28.1) v1(48.1,28.05) v1(48.1,1.9)
ADC1_CH3: length 7.2
  Top Layer w0.254: R8.1 16.61,5.34 16.96,5.68 21.05,5.68 U4.15
D+: length 3.6
  Top Layer w0.254: 12.33,7.08 13.02,7.08 13.46,7.52 14.07,7.52 14.64,6.95 R4.2
D-: length 3.7
  Top Layer w0.254: D1.6 13.02,8.98 13.77,8.23 14.43,8.23 15.05,8.85 R5.2
EN: length 15.8
  Top Layer w0.254: 38.6,2.64 40.35,2.64 R6.1 40.38,6.62 40.77,7.01 43.31,7.01 44.2,6.12 46.16,6.12 46.16,8.09 45.57,8.68 SW2.2
I2C_SCL: length 62.1
  Top Layer w0.254: 21.34,28.98 16,28.98 15.49,28.48 15.49,25.3 14.99,24.79 11.18,24.79 10.41,25.56 H2.3 ; 21.34,28.98 21.34,27.84 20.97,27.48 U2.2 ; 21.34,28.98 22.86,28.98 ; 22.86,28.98 22.86,28.09 23.19,27.77 U1.4 ; 22.86,28.98 36.45,28.98 37.16,28.27 37.16,5.82 37.34,5.64 38.6,5.64
I2C_SDA: length 60.5
  Top Layer w0.254: 21.34,23.9 22.7,23.9 ; 21.34,23.9 8.64,23.9 7.87,24.67 H2.2 ; 21.34,23.9 21.34,23.91 21.34,26.32 20.97,26.68 U2.1 ; 22.7,23.9 22.73,23.94 22.73,26.06 23.14,26.47 U1.6 ; 22.7,23.9 34.92,23.9 36.32,22.51 36.32,4.54 36.72,4.14 38.6,4.14
IO2: length 3.2
  Top Layer w0.254: R11.1 19.18,3.71 19.61,4.14 U4.16
IO8: length 2.3
  Top Layer w0.254: R12.1 38.64,10.19 38.6,10.14
IO9: length 14.6
  Top Layer w0.254: 38.6,11.64 38.65,11.59 43.31,11.59 43.69,11.97 43.69,14.76 44.07,15.14 46.16,15.14 46.16,12.92 45.76,12.52 SW3.2
LED_B: length 17
  Top Layer w0.254: U4.17 24.2,2.64 24.76,3.2 24.76,15.59 24.77,15.59 LED3.1
LED_R: length 19.4
  Top Layer w0.254: LED2.1 26.66,14.75 25.65,13.74 25.65,2.31 24.48,1.14 U4.18
RAW_D+: length 5.6
  Top Layer w0.254: 10.03,7.08 8.25,7.08 7.74,7.59 7.15,7.59 USB1.B6 7.15,7.73 7.74,7.73 7.9,7.89 7.9,8.43 7.74,8.59 7.22,8.59 7.17,8.64 7.1,8.64 USB1.A6
RAW_D-: length 5.4
  Top Layer w0.254: USB1.A7 7,8.23 6.41,8.23 6.25,8.39 6.25,8.93 6.41,9.09 7,9.09 USB1.B7 7.15,9.09 7.81,9.09 7.92,8.98 D1.1
RXD: length 37
  Top Layer w0.254: U4.11 v2(23.37,11.64)
  Bottom Layer w0.254: H1.3 42.42,22.38 41.53,21.49 41.53,12.35 40.82,11.64 v2(23.37,11.64)
TXD: length 36
  Top Layer w0.254: U4.12 v2(23.37,10.14)
  Bottom Layer w0.254: H1.2 44.03,19.84 43.21,19.02 43.21,10.85 42.5,10.14 v2(23.37,10.14)
$1N25: length 6.3
  Top Layer w0.254: v2(5.46,8.66) 4.95,8.66 4.7,8.92 4.7,10.31 4.91,10.52 6.02,10.52 6.22,10.31 6.22,9.92 6.41,9.73 7,9.73 USB1.A5
  Bottom Layer w0.254: v2(5.46,8.66) 5.45,8.67 R1.1
$1N26: length 3.1
  Top Layer w0.254: USB1.B5 7,6.73 6.41,6.73 6.25,6.89 6.25,7.37 6.1,7.52 v2(5.59,7.52)
  Bottom Layer w0.254: R2.1 5.59,6.77 v2(5.59,7.52)
$1N67: length 4.6
  Top Layer w0.254: U4.14 19.84,7.14 19.29,7.69 18.87,7.69 18.86,7.7 18.21,7.7 17.47,6.95 R4.1
$1N125: length 1.7
  Top Layer w0.254: R8.2 16.4,1.09 U3.2
$1N130: length 5.7
  Top Layer w0.254: C11.1 C12.1 10.19,1.31 R7.2 12.92,1.31 13.13,1.09 U3.1
$1N133: length 4.6
  Top Layer w0.254: R5.1 17.47,8.85 18.21,8.11 19.03,8.11 19.04,8.09 19.29,8.09 19.84,8.64 U4.13
$1N168: length 1.5
  Top Layer w0.254: R3.1 18.8,19.16 LED1.2
$1N183: length 1.6
  Top Layer w0.254: LED3.2 24.77,19.33 R13.1
$1N184: length 1.6
  Top Layer w0.254: LED2.2 26.66,19.33 R14.1

## Copper pours and planes (outline as drawn; the poured copper is in the pictures)
GND on Top Layer: 0,30 50,30 50,0 0,0
GND on Bottom Layer: 0,30 50,30 50,0 0,0

Small or netless copper shapes (teardrops, artwork), in the pictures only: 127 on Top Layer, 26 on Bottom Layer

## Text on the board
Top Silkscreen Layer: 3V3 | SDA | SCL | G | RXD | TXD | 3V | PWR | Sleep Monitor System | IO9 | RST

# Board failed
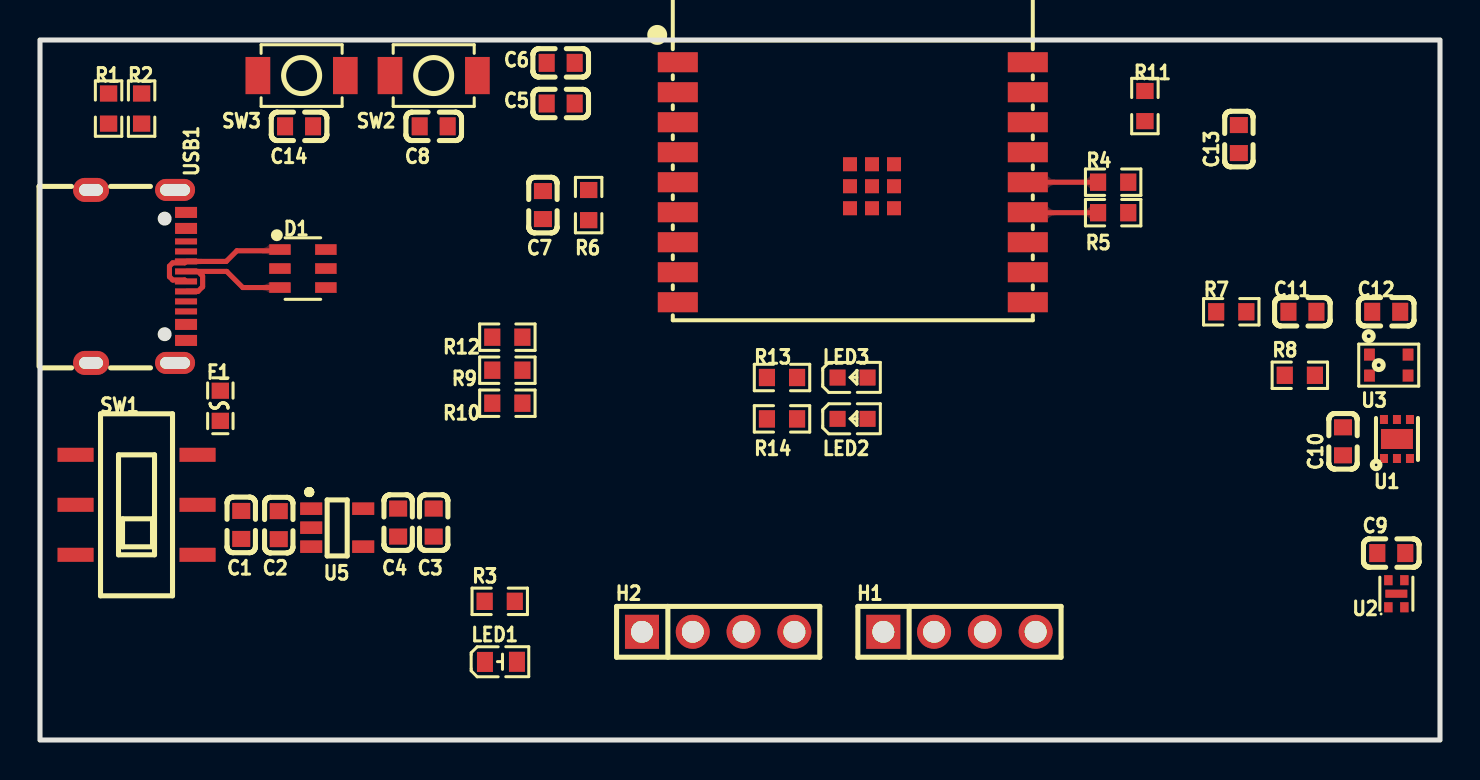
[diagram p3: board, top side]
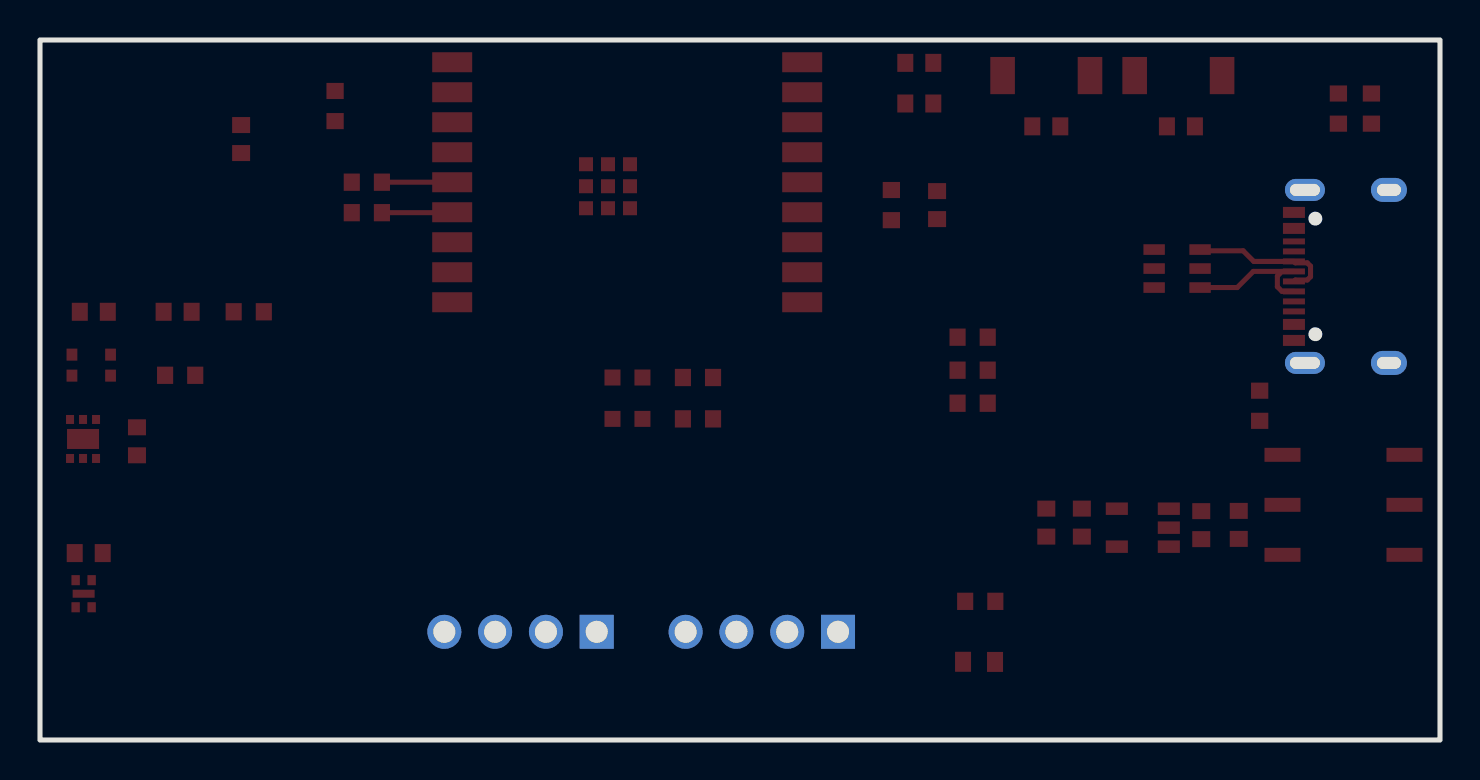
[diagram p4: board, bottom side, seen from below]

Outline 70 x 35 mm; copper layers: Top Layer, Bottom Layer. Coordinates in mm from the lower left corner of the outline.
Outline path: rectangle 0,35 70,0
Stack: Top Layer 0.035mm / Dielectric1 1.51mm FR4 er 4.5 / Bottom Layer 0.035mm

## Design rules (mm)
net RAW_D+: DP1
net RAW_D-: DP1
net D-: DP2
net D+: DP2
net $1N67: DP3
net $1N133: DP3
spacing copperThickness1oz (default): track to track 0.102, other pairs 0.152 to 0.3
spacing copperThickness2oz: track to track 0.203, other pairs 0.152 to 0.3
track width copperThickness1oz (default): min 0.127, default 0.254, max 2.54
track width copperThickness2oz: min 0.203, default 0.254, max 2.54
differential pair differentialPair (default): width min 0.127, default 0.254, max 2.54; gap min 0.152, default 0.152

## Placement (name value [footprint] x y rotation side)
C1  10uF  [C0603]  10.06 10.75 90 top
C2  100nF  [C0603]  11.94 10.74 90 top
C3  10uF  [C0603]  19.69 10.87 90 top
C4  100nF  [C0603]  17.91 10.87 90 top
C5  10uF  [C0603]  26.03 31.83 180 top
C6  100nF  [C0603]  26.03 33.86 180 top
C7  1uF  [C0603]  25.15 26.75 270 top
C8  100nF  [C0603]  19.69 30.68 0 top
C9  100nF  [C0603]  67.56 9.35 0 top
C10  100nF  [C0603]  65.15 14.93 90 top
C11  1uF  [C0603]  63.12 21.41 0 top
C12  100nF  [C0603]  67.31 21.41 0 top
C13  10nF  [C0603]  59.94 30.05 90 top
C14  100nF  [C0603]  12.95 30.68 180 top
D1  USBLC6-2SC6  [SOT-23-6_L2.9-W1.6-P0.95-LS2.8-BL]  13.14 23.57 270 top
F1  SMD0603-075  [F0603]  9.02 16.71 270 top
H1  PZ254V-11-04P  [HDR-TH_4P-P2.54-V-M]  45.97 5.41 0 top
H2  PZ254V-11-04P  [HDR-TH_4P-P2.54-V-M]  33.91 5.41 0 top
LED1  NCD0603G1  [LED0603-RD_1]  23.05 3.91 0 top
LED2  NCD0603R5  [LED0603-RD]  40.63 16.06 0 top
LED3  NCD0603B1  [LED0603-RD]  40.63 18.12 0 top
R1  5.1kΩ  [R0603]  3.43 31.57 90 top
R2  5.1kΩ  [R0603]  5.08 31.57 90 top
R3  4.7kΩ  [R0603]  22.99 6.93 0 top
R4  0Ω  [R0603]  53.66 27.89 0 top
R5  0Ω  [R0603]  53.66 26.37 0 top
R6  10kΩ  [R0603]  27.43 26.75 270 top
R7  22Ω  [R0603]  59.56 21.41 0 top
R8  1kΩ  [R0603]  62.99 18.24 0 top
R9  4.7kΩ  [R0603]  23.37 18.49 0 top
R10  4.7kΩ  [R0603]  23.37 16.84 0 top
R11  10kΩ  [R0603]  55.25 31.7 90 top
R12  10kΩ  [R0603]  23.37 20.14 180 top
R13  4.7kΩ  [R0603]  37.1 18.12 180 top
R14  4.7kΩ  [R0603]  37.1 16.06 180 top
SW1  SS-3235S-L1  [SW-SMD_SS-3235S-LX]  4.83 11.76 270 top
SW2  TS-1088-AR02016  [SW-SMD_L3.9-W3.0-P4.45]  19.69 33.22 0 top
SW3  TS-1088-AR02016  [SW-SMD_L3.9-W3.0-P4.45]  13.08 33.22 180 top
U1  OPT3001IDNPRQ1  [WSON-6_L2.0-W2.0-P0.65-BL-EP]  67.85 15.05 0 top
U2  SHT40-AD1B-R3  [DFN-4_L1.5-W1.5-P0.8-TL-EP]  67.82 7.31 90 top
U3  MSM381ACP003  [MIC-SMD_4P-L2.8-W1.9-TR_MSM381ACP003]  67.44 18.74 90 top
U4  2.4GHz  [BULETM-SMD_ESPRESSIF_ESP32-C3-WROOM-02-N4-4MB]  40.64 27.89 0 top
U5  AP2112K-3.3TRG1  [SOT-25-5_L2.9-W1.6-P0.95-LS2.8-BL]  14.86 10.62 270 top
USB1  TYPE-C 16PIN 2MD(073)  [USB-C-SMD_TYPE-C-16PIN-2MD-073]  4.93 23.18 270 top

## Footprints (pads in the part's own frame, mm; a bottom-side part is the same pattern mirrored in y, then rotated)
BULETM-SMD_ESPRESSIF_ESP32-C3-WROOM-02-N4-4MB
  rect 2x1 smd: 1(-8.75,6) 2(-8.75,4.5) 3(-8.75,3) 4(-8.75,1.5) 5(-8.75,0) 6(-8.75,-1.5) 7(-8.75,-3) 8(-8.75,-4.5) 9(-8.75,-6) 10(8.75,-6) 11(8.75,-4.5) 12(8.75,-3) 13(8.75,-1.5) 14(8.75,0) 15(8.75,1.5) 16(8.75,3) 17(8.75,4.5) 18(8.75,6)
  rect 0.7x0.7 smd: 19(-0.14,0.9) 19(-0.14,-0.2) 19(-0.14,-1.3) 19(0.96,0.9) 19(0.96,-0.2) 19(0.96,-1.3) 19(2.06,0.9) 19(2.06,-0.2) 19(2.06,-1.3)
C0603
  rect 0.8x0.9 smd: 1(-0.7,0) 2(0.7,0)
DFN-4_L1.5-W1.5-P0.8-TL-EP
  rect 0.505x0.42 smd: 1(-0.677,0.4) 2(-0.677,-0.4) 3(0.677,-0.4) 4(0.677,0.4)
  rect 0.4x1.1 smd: 5(0,0)
F0603
  rect 0.806x0.864 smd: 1(-0.753,0) 2(0.753,0)
HDR-TH_4P-P2.54-V-M
  rect 1.7x1.7 hole 1.1: 1(-3.81,0)
  round 1.7 hole 1.1: 2(-1.27,0) 3(1.27,0) 4(3.81,0)
LED0603-RD
  rect 0.8x0.8 smd: 1(-0.749,0) 2(0.749,0)
LED0603-RD_1
  rect 0.8x1 smd: 1(-0.799,-0.004) 2(0.799,0.004)
MIC-SMD_4P-L2.8-W1.9-TR_MSM381ACP003
  rect 0.6x0.54 smd: 1(0.525,0.965) 2(-0.525,0.965) 3(-0.525,-0.965) 4(0.525,-0.965)
R0603
  rect 0.806x0.864 smd: 1(-0.753,0) 2(0.753,0)
SOT-23-6_L2.9-W1.6-P0.95-LS2.8-BL
  rect 0.532x1.072 smd: 1(-0.95,-1.149) 2(0,-1.149) 3(0.95,-1.149) 4(0.95,1.149) 5(0,1.149) 6(-0.95,1.149)
SOT-25-5_L2.9-W1.6-P0.95-LS2.8-BL
  rect 0.623x1.105 smd: 1(-0.95,-1.3) 2(-0.001,-1.3) 3(0.95,-1.3) 4(0.95,1.3) 5(-0.95,1.3)
SW-SMD_L3.9-W3.0-P4.45
  rect 1.23x1.86 smd: 1(-2.185,0) 2(2.185,0)
SW-SMD_SS-3235S-LX
  rect 0.7x1.8 smd: 1(-2.5,3.05) 2(0,3.05) 3(2.5,3.05) 4(-2.5,-3.05) 5(0,-3.05) 6(2.5,-3.05)
USB-C-SMD_TYPE-C-16PIN-2MD-073
  oval 1.1x2 hole 0.6x1.5: 13(-4.325,1.825) 14(4.325,1.825)
  oval 1.2x1.8 hole 0.6x1.2: 13(-4.325,-2.375) 14(4.325,-2.375)
  rect 0.55x1.1 smd: A1B12(-3.2,2.375) A4B9(-2.4,2.375) B1A12(3.2,2.375) B4A9(2.4,2.375)
  rect 0.3x1.1 smd: A5(-1.25,2.375) A6(-0.25,2.375) A7(0.25,2.375) A8(1.25,2.375) B5(1.75,2.375) B6(0.75,2.375) B7(-0.75,2.375) B8(-1.75,2.375)
WSON-6_L2.0-W2.0-P0.65-BL-EP
  rect 0.4x0.45 smd: 1(-0.65,-0.975) 2(0,-0.975) 3(0.65,-0.975) 4(0.65,0.975) 5(0,0.975) 6(-0.65,0.975)
  rect 1.6x1 smd: 7(0,0)

## Nets
+3.3V: C3.2 C4.2 C5.1 C6.1 C7.2 C9.2 C10.1 H1.1 H2.1 R3.2 R6.2 R7.1 R9.1 R10.1 R11.2 R12.2 R13.2 R14.2 U1.1 U1.2 U2.3 U4.1 U5.5
+5V: C1.2 C2.2 SW1.2 SW1.3 U5.1 U5.3
GND: C1.1 C2.1 C3.1 C4.1 C5.2 C6.2 C7.1 C8.1 C9.1 C10.2 C11.2 C12.2 C13.2 C14.1 D1.2 H1.4 H2.4 LED1.1 R1.2 R2.2 SW1.4 SW1.5 SW1.6 SW2.1 SW3.1 U1.3 U1.7 U2.4 U2.5 U3.3 U3.4 U4.9 U4.19 U5.2 USB1.13 USB1.14 USB1.A1B12 USB1.B1A12
VBUS: D1.5 F1.1 USB1.A4B9 USB1.B4A9
VCC+5V: F1.2 SW1.1
ADC1_CH3: C13.1 R8.1 U4.15
D+: D1.4 R4.2
D-: D1.6 R5.2
EN: C8.2 R6.1 SW2.2 U4.2
I2C_SCL: H2.3 R10.2 U1.4 U2.2 U4.4
I2C_SDA: H2.2 R9.2 U1.6 U2.1 U4.3
IO2: R11.1 U4.16
IO8: R12.1 U4.7
IO9: C14.2 SW3.2 U4.8
LED_B: LED3.1 U4.17
LED_R: LED2.1 U4.18
RAW_D+: D1.3 USB1.A6 USB1.B6
RAW_D-: D1.1 USB1.A7 USB1.B7
RXD: H1.3 U4.11
TXD: H1.2 U4.12
$1N25: R1.1 USB1.A5
$1N26: R2.1 USB1.B5
$1N67: R4.1 U4.14
$1N125: R8.2 U3.2
$1N130: C11.1 C12.1 R7.2 U3.1
$1N133: R5.1 U4.13
$1N168: LED1.2 R3.1
$1N183: LED3.2 R13.1
$1N184: LED2.2 R14.1

Pads without a net: U1 5; U4 5 6 10; U5 4; USB1 A8 B8

## Routing (per net, layer and track width the routed paths; a pad name or vN(x,y) marks a point on that pad's centre or on a via; arc(x,y) is an arc through that point)
RAW_D+: length 6.8
  Top Layer w0.254: USB1.B6 7.9,22.43 8.13,22.66 8.13,23.19 7.9,23.43 ; USB1.A6 7.9,23.43 ; 7.9,23.43 9.33,23.43 10.14,22.62 D1.3
RAW_D-: length 7.3
  Top Layer w0.254: 7.3,22.93 7.23,23 6.64,23 6.47,23.16 6.47,23.69 6.64,23.86 7.23,23.86 7.3,23.93 9.31,23.93 9.84,24.46 11.93,24.46 D1.1
$1N67: length 3.5
  Top Layer w0.254: U4.14 49.39,27.89 R4.1
$1N133: length 3.5
  Top Layer w0.254: R5.1 49.41,26.37 U4.13

Small or netless copper shapes (teardrops, artwork), in the pictures only: 11 on Top Layer
